# Altium schematic sheet Copy of pilpal_final.SchDoc
size 420 x 297 mm; SheetNumber: 1; SheetTotal: 1
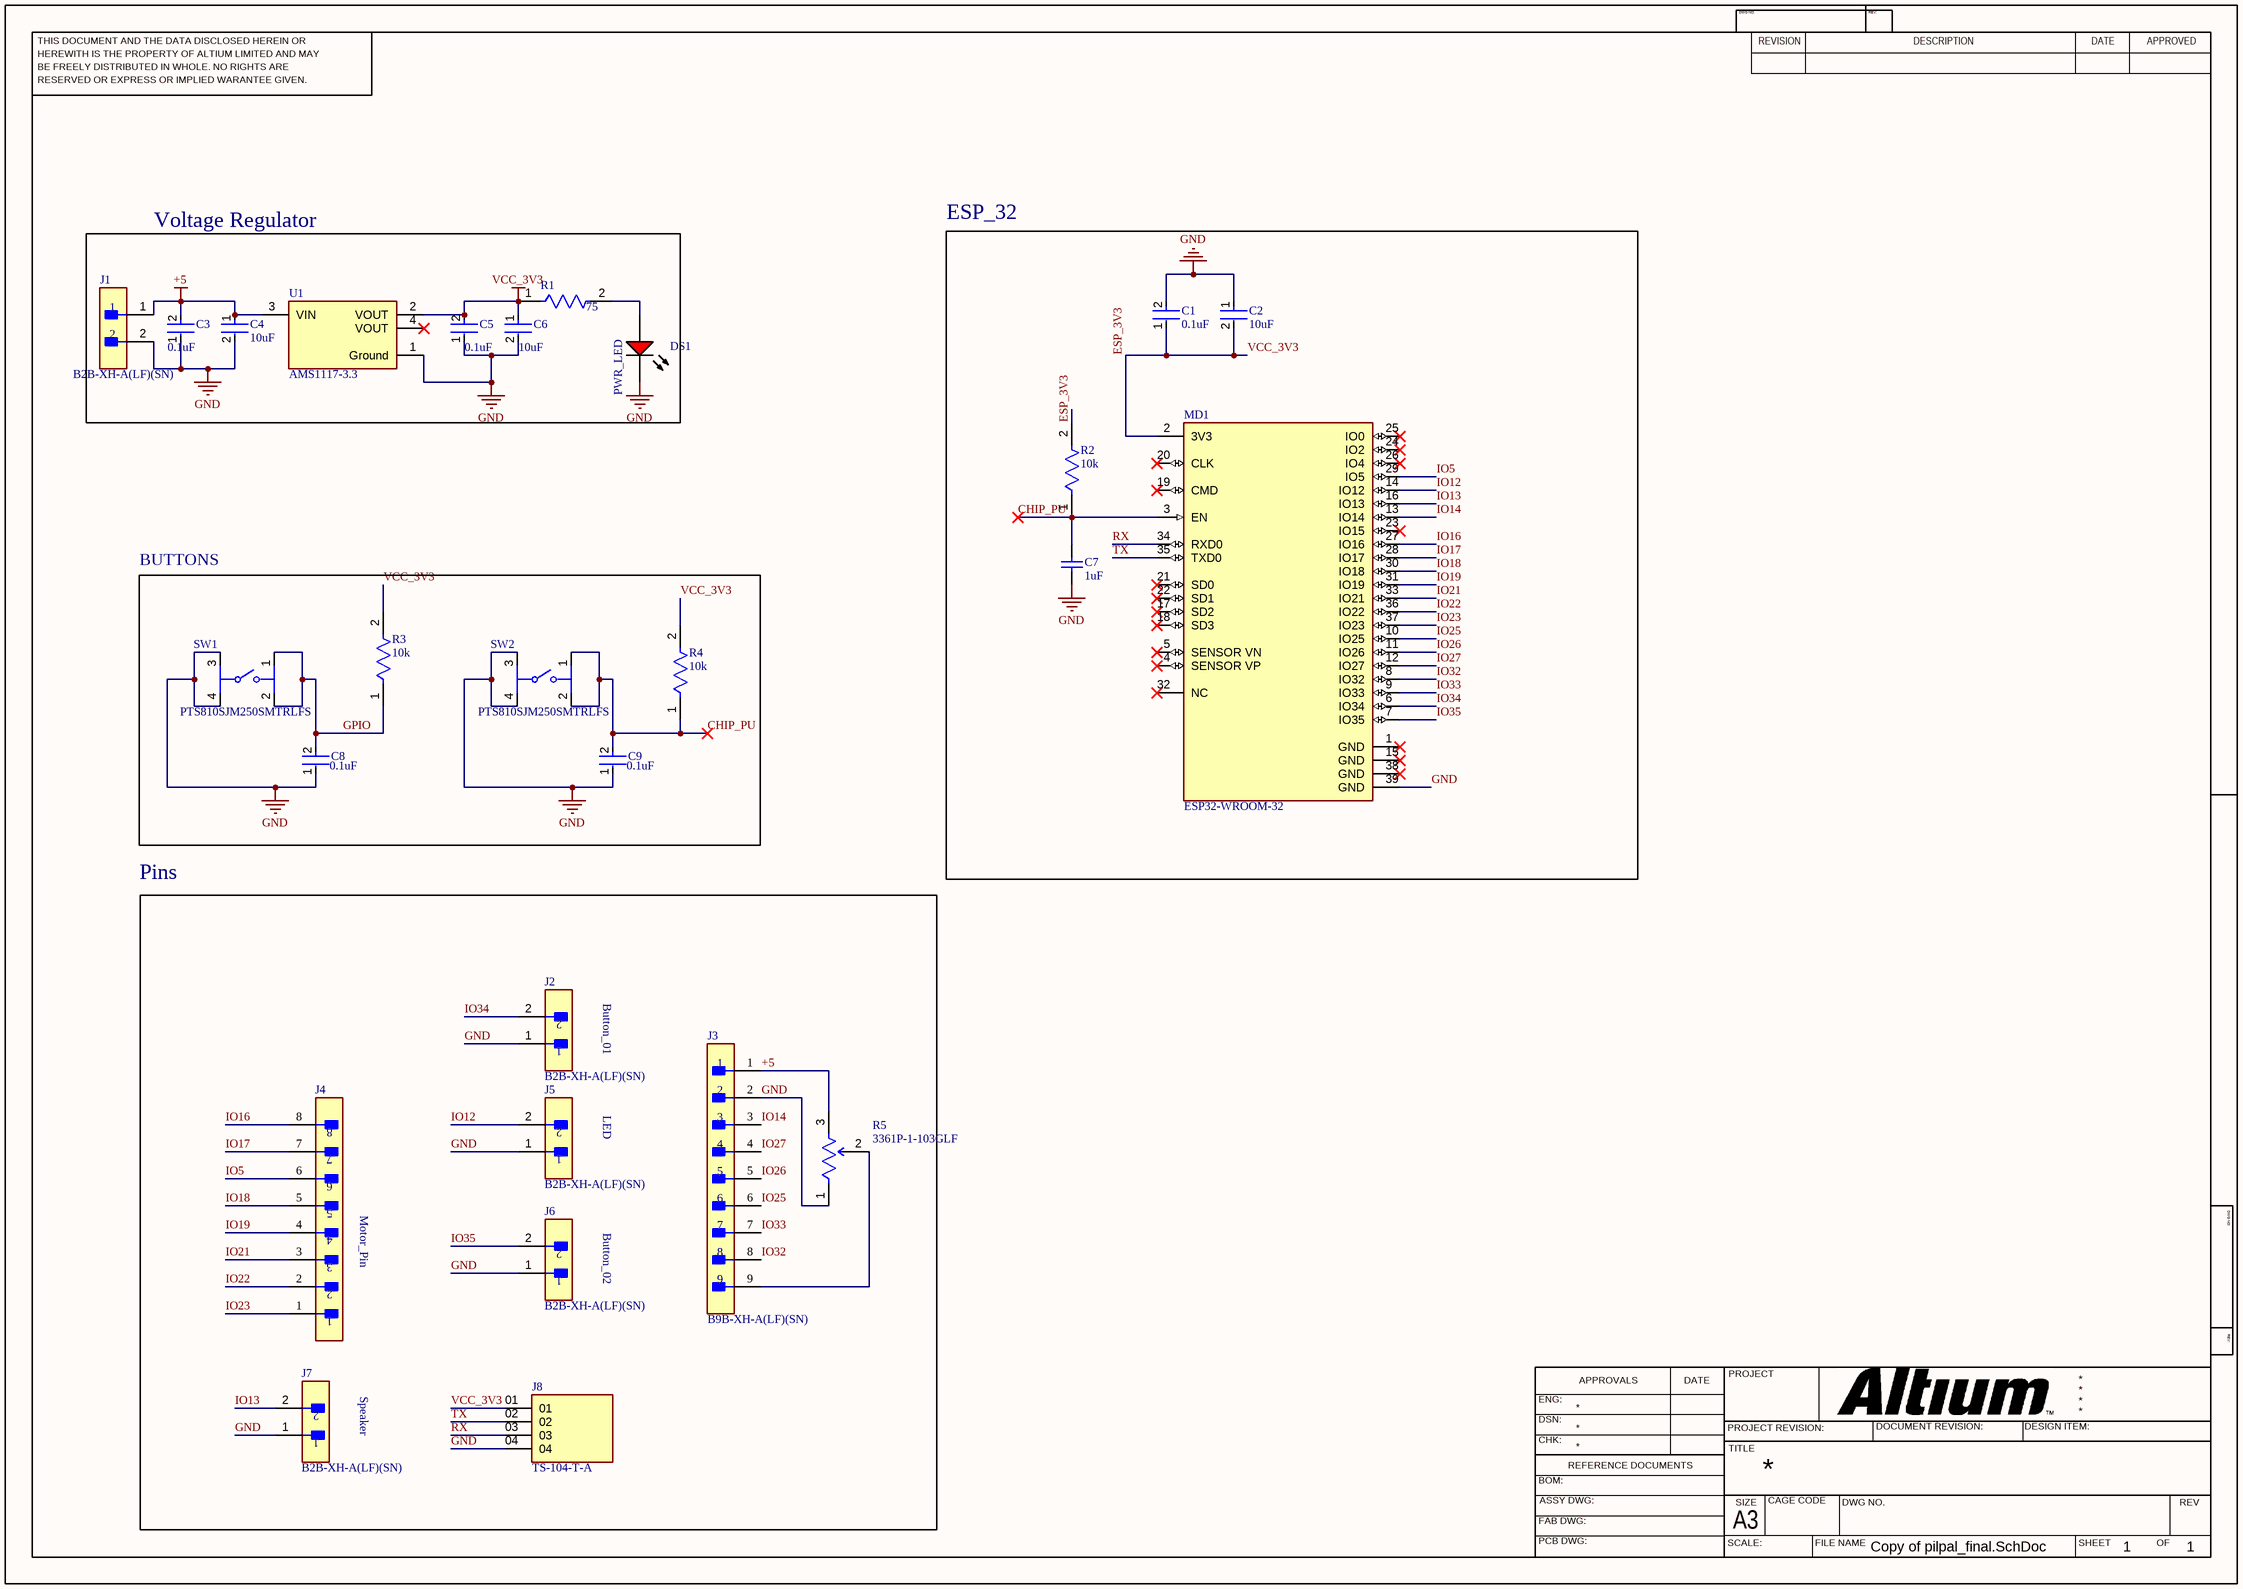
[diagram p0: Copy of pilpal_final.SchDoc]

## Parts
C1  0.1uF  [FP-GRM15-MFG]
C2  10uF  [FP-GRM188-0_1-e0_2_0_55-IPC_A]
C3  0.1uF  [FP-GRM15-MFG]
C4  10uF  [FP-GRM188-0_1-e0_2_0_55-IPC_A]
C5  0.1uF  [FP-GRM15-MFG]
C6  10uF  [FP-GRM188-0_1-e0_2_0_55-IPC_A]
C7  1uF  [CAPC2013X145X50ML20T25]
C8  0.1uF  [FP-GRM15-MFG]
C9  0.1uF  [FP-GRM15-MFG]
DS1  PWR_LED  [AVAG-HSMX-C150_V]
J1  B2B-XH-A(LF)(SN)  [FP-B2B-XH-A_LF_SN-MFG]
J2  B2B-XH-A(LF)(SN)  [FP-B2B-XH-A_LF_SN-MFG]
J3  B9B-XH-A(LF)(SN)  [FP-B9B-XH-A_LF_SN-MFG]
J4  B8B-XH-A(LF)(SN)  [FP-B8B-XH-A_LF_SN-MFG]  (value not drawn)
J5  B2B-XH-A(LF)(SN)  [FP-B2B-XH-A_LF_SN-MFG]
J6  B2B-XH-A(LF)(SN)  [FP-B2B-XH-A_LF_SN-MFG]
J7  B2B-XH-A(LF)(SN)  [FP-B2B-XH-A_LF_SN-MFG]
J8  TS-104-T-A  [SAMTEC_TS-104-T-A]
MD1  ESP32-WROOM-32  [FP-ESP32-WROOM-32-MFG]
R1  75  [FP-RN731J-MFG]
R2  10k  [FP-CRG0805-IPC_C]
R3  10k  [FP-CRG0805-IPC_C]
R4  10k  [FP-CRG0805-IPC_C]
R5  3361P-1-103GLF  [FP-3361P-MFG]
SW1  PTS810SJM250SMTRLFS  [FP-PTS810SJM250SMTRLFS-MFG]
SW2  PTS810SJM250SMTRLFS  [FP-PTS810SJM250SMTRLFS-MFG]
U1  AMS1117-3.3  [FP-AMS1117-IPC_C]

## Blocks framed on the sheet
Voltage Regulator: C3-C6 DS1 J1 R1 U1
ESP_32: C1 C2 C7 MD1 R2
BUTTONS: C8 C9 R3 R4 SW1 SW2
Pins: J2-J8 R5

## Nets
+5: C3.2 C4.1 J1.1 J3.1 R5.3(CW) U1.3(VIN)
ESP_3V3: C1.1 C2.2 C5.2 C6.1 J8.01 MD1.2(3V3) R1.1 R2.2 R3.2 R4.2 U1.2(VOUT)  [also labelled VCC_3V3]
GND: C1.2 C2.1 C3.1 C4.2 C5.1 C6.2 C7.1 C8.1 C9.1 DS1.2(K) J1.2 J2.1 J3.2 J5.1 J6.1 J7.1 J8.04 MD1.39(GND) R5.1(CCW) SW1.3 SW1.4 SW2.3 SW2.4 U1.1(Ground)
CHIP_PU: C7.2 C9.2 MD1.3(EN) R2.1 R4.1 SW2.1 SW2.2
GPIO: C8.2 R3.1 SW1.1 SW1.2
IO5: J4.6 MD1.29(IO5)
IO12: J5.2 MD1.14(IO12)
IO13: J7.2 MD1.16(IO13)
IO14: J3.3 MD1.13(IO14)
IO16: J4.8 MD1.27(IO16)
IO17: J4.7 MD1.28(IO17)
IO18: J4.5 MD1.30(IO18)
IO19: J4.4 MD1.31(IO19)
IO21: J4.3 MD1.33(IO21)
IO22: J4.2 MD1.36(IO22)
IO23: J4.1 MD1.37(IO23)
IO25: J3.6 MD1.10(IO25)
IO26: J3.5 MD1.11(IO26)
IO27: J3.4 MD1.12(IO27)
IO32: J3.8 MD1.8(IO32)
IO33: J3.7 MD1.9(IO33)
IO34: J2.2 MD1.6(IO34)
IO35: J6.2 MD1.7(IO35)
RX: J8.03 MD1.34(RXD0)
TX: J8.02 MD1.35(TXD0)
NetDS1_1: DS1.1(A) R1.2
NetJ3_9: J3.9 R5.2(WIPER)

Not connected (* = marked no-connect by the designer): MD1 1(GND)* 4(SENSOR_VP)* 5(SENSOR_VN)* 15(GND)* 17(SD2)* 18(SD3)* 19(CMD)* 20(CLK)* 21(SD0)* 22(SD1)* 23(IO15)* 24(IO2)* 25(IO0)* 26(IO4)* 32(NC)* 38(GND)*; U1 4(VOUT)*

## Notes on the sheet
- Button_01
- LED
- (near J4) Motor_Pin
- Button_02
- Speaker
- THIS DOCUMENT AND THE DATA DISCLOSED HEREIN OR
- HEREWITH IS THE PROPERTY OF ALTIUM LIMITED AND MAY
- DWG NO:
- REVISION
- REV:
- DESCRIPTION
- DATE
- APPROVED
- BE FREELY DISTRIBUTED IN WHOLE. NO RIGHTS ARE
- RESERVED OR EXPRESS OR IMPLIED WARANTEE GIVEN.
- ENG:
- APPROVALS
- PROJECT
- DSN:
- CHK:
- REFERENCE DOCUMENTS
- PROJECT REVISION:
- TITLE
- DOCUMENT REVISION:
- DESIGN ITEM:
- BOM:
- FAB DWG:
- PCB DWG:
- ASSY DWG:
- SCALE:
- A3
- SIZE
- CAGE CODE
- FILE NAME
- DWG NO.
- SHEET
- OF
- REV

## Library data of the parts
C1 C3 C5 C8 C9 = CMP-2100-03641-2: CAP CER 0.1UF 16V X7R 0402; Manufacturer Part Number: GRM155R71C104KA88D; Manufacturer: Murata; Standoff Height: 0mm; Tolerance: 10%; Voltage Rating: 16Vdc; Material: Ceramic; Capacitance: 0.10μF; Value: 0.10μF; RoHS: TRUE; Temperature Characteristic: X7R; Octopart: https://octopart.com/grm155r71c104ka88d-murata-196880; Digikey Description: CAP CER 0.1UF 16V X7R 0402; Device Class L3: Ceramic Capacitors; Height: 0.55mm; ComponentLink2Description: Datasheet; Temperature Range Low: -55°C; Ipc Land Pattern Name: CAPC10050X219; ComponentLink2URL: https://search.murata.co.jp/Ceramy/image/img/A01X/G101/ENG/GRM155R71H471KA01-01A.pdf; Device Class L1: Passive Components; Lead Free: yes; Category: Cap; Package: GRM15; Temperature: -55°C to +125°C; Device Class L2: Capacitors; Temperature Range High: +125°C; Mouser Description: 0402 0.1 uF 16V ±10 % Tolerance X7R SMT Multilayer Ceramic Capacitor
C2 C4 C6 = CMP-2006-02792-2: Chip Multilayer Ceramic Capacitors for General Purpose, 0603, 10uF, X5R, 15%, 20%, 6.3V; Packaging: Tape and Reel; Voltage Rating (DC): 6.3V; Width: 0.031inch; Termination: SMD/SMT; Dielectric: X5R; Package Quantity: 4000; Voltage Rating: 6.3V; Capacitance: 10uF; Case/Package: 0603; Min Operating Temperature: -55°C; Voltage: 6.3V; Length: 1.6mm; Thickness: 0.035inch; Lead Free: Lead Free; Depth: 0.8mm; Case Code (Imperial): 0603; Max Operating Temperature: 85°C; Material: Ceramic; Height: 0.8mm; Tolerance: 20%; Mount: Surface Mount; REACH SVHC: No SVHC; Radiation Hardening: No; Case Code (Metric): 1608
C7 = CMP-1036-04731-2: Part Number: C0805C105K9PACTU; Manufacturer: Kemet
DS1 = CMP-2000-06426-1: LED Uni-Color Red, 65 mW, 25 mA, -40 to 85 degC, 2-Pin SMD, RoHS, Tape and Reel; Manufacturer: Avago; Product Height (mm): 1.1mm; Power Dissipation: 78W; Product Length (mm): 3.2mm; Forward Voltage: 2.6V; Luminous Intensity: 17mcd; DELETED: Compliant; Shape Type: Rectangular; Peak Wavelength: 660nm; Main Category: ChipLED; Dominant Wave Length: 639nm; Rad Hardened: No; Lens Type: ColorlessDiffused; Product Depth (mm): 1.6mm; Reverse Voltage: 5V; Forward Current: 25mA; Chip Material: GaAlAs; Test Current (It): 20mA; Viewing Angle: 170deg; Number of  Elements: 1; Type: Uni-Color; Package Reference: HSMX-C150; Package Description: 2-Pin Surface Mount Device, Body 3.2 x 1.6 mm; Operating Temp Range: -40Cto85C; Mounting: SurfaceMount; Emitting Color: Red; Pin Count: 2; Operating Temperature Classification: Industrial; Datasheet URL: http://media.digikey.com/pdf/Data%20Sheets/Avago%20PDFs/HSMz-Czzz.pdf; Package Type: ChipLed; Mounting Technology: SurfaceMount; High Brightness: No; Lens Dimensions: 2x1.6x0.6mm; Manufacturer URL: http://www.avagotech.com/; Lum Intensity: 17mcd; Datasheet Version: 03/2012; Packaging: TapeandReel
J1 J2 J5-J7 = CMP-2000-05888-3: CONN HEADER VERT 2POS 2.5MM; Current Rating: 3A; Voltage Rating: 250V; Number of Contacts: 2; Contact Resistance: 20mR; Wire/Cable Gauge: 22AWG; Insulation Resistance: 1GR; Connector Type: Male Pin; Packaging: Bulk; Contact Material: Brass; Lead Free: Lead Free; Orientation: Straight; Contact Plating: Tin; Max Current Rating: 3A; Termination: Solder; Fastening Type: Detent; Depth: 5.75mm; Housing Material: Polyamide; REACH SVHC: No SVHC; Series: XH; Voltage Rating (AC): 250V; Number of Positions: 2; Color: Natural; Contact Type: Male Pin; Max Voltage Rating (DC): 250V; Pitch: 2.5mm; Lead Pitch: 2.5mm; Mount: Through Hole; Max Operating Temperature: 85°C; Length: 7.4mm; Max Voltage Rating (AC): 250V; Min Operating Temperature: -25°C; Number of Rows: 1; Housing Color: White
J3 = CMP-17439-000168-1: CONN HEADER VERT 9POS 2.5MM; Wire/Cable Gauge: 22AWG; Current Rating: 3A; Insulation Resistance: 1GR; Mated Stacking Heights: 9.8mm; Max Voltage Rating (AC): 250V; Contact Resistance: 20mR; Gender: Male; Number of Contacts: 9; Orientation: Straight; Contact Finish - Mating: TIN; Number of Rows: 1; Max Operating Temperature: 85°C; Contact Plating: Tin; Flammability Rating: UL94 V-0; Length: 24.9mm; REACH SVHC: No SVHC; Depth: 5.75mm; Housing Color: White; Package Quantity: 250; Lead Pitch: 2.5mm; Connector Type: Header; Voltage Rating (AC): 250V; Packaging: Bulk; Color: Natural; Min Operating Temperature: -25°C; Insulation Color: Natural; Insulation Material: Nylon; Voltage Rating: 250V; Pitch: 2.5mm; Lead Free: Lead Free; Contact Shape: Square; Housing Material: Polyamide; Series: XH; Termination: Solder; Contact Type: Male Pin; Mount: Through Hole; Max Current Rating: 3A; Number of Positions: 9; Contact Material: Brass; Fastening Type: Detent
J4 = CMP-17438-000015-1: CONN HEADER VERT 8POS 2.5MM; Voltage Rating (AC): 250V; Insulation Resistance: 1GR; Connector Type: Male Pin; Max Current Rating: 3A; Wire/Cable Gauge: 22AWG; Number of Contacts: 8; Contact Resistance: 20mR; Orientation: Straight; Pitch: 2.5mm; Min Operating Temperature: -25°C; Number of Rows: 1; Contact Type: Male Pin; Packaging: Bulk; Lead Free: Lead Free; Max Operating Temperature: 85°C; Housing Material: Polyamide; Voltage Rating: 250V; Series: XH; Mount: Through Hole; Depth: 5.75mm; Contact Material: Brass; Fastening Type: Detent; Color: Natural; Max Voltage Rating (AC): 250V; Number of Positions: 8; Housing Color: White; Contact Plating: Tin; Lead Pitch: 2.5mm; Length: 22.4mm; REACH SVHC: No SVHC; Termination: Press-Fit; Current Rating: 3A
J8 = TS-104-T-A: TS - Samtec 2.54mm Single Row Machined Terminal Strip - Fast Stock; MF: Samtec Inc.; Check_prices: https://www.snapeda.com/parts/TS-104-T-A/Samtec+Inc./view-part/?ref=eda; Value: *; Availability: In Stock; Price: None; Package: None; MP: TS-104-T-A; SnapEDA_Link: https://www.snapeda.com/parts/TS-104-T-A/Samtec+Inc./view-part/?ref=snap; Purchase-URL: https://pricing.snapeda.com/search/part/TS-104-T-A/?ref=eda; Supplier 1: Digikey; Supplier Part Number 1: SAM1112-04-ND
MD1 = CMP-194065-000008-1: RX TXRX MOD WIFI SURFACE MOUNT; Frequency: 2.5GHz; Sensitivity: -98dBm; Operating Supply Voltage: 3.6V; Data Rate: 150Mbps; Weight: 0.088185oz; Package Quantity: 550; Min Operating Temperature: -40°C; Mount: Surface Mount; Max Operating Temperature: 85°C; Packaging: Cut Tape; Case/Package: SMD/SMT
R1 = CMP-03211-006003-1: Thin Film Resistors RN 0603 750Ω 0.1% 10ppm/°C; Manufacturer: TE Connectivity; Manufacturer Part Number: RN73C1J750RBTG; Voltage Rating: 50V; Power Rating: 0.063W; Tolerance: 0.1%; Resistance: 750Ω; Device Class L3: Chip SMD Resistors; Lead Free: Yes; Series: RN73; Device Class L2: Resistors; Temperature Coefficient: 10ppm/°C; Height: 0.55mm; Ipc Land Pattern Name: RESC15580X45; Category: Res; Value: 750Ω; Temperature Range Low: -55°C; ComponentLink2URL: https://www.te.com/commerce/DocumentDelivery/DDEController?Action=showdoc&DocId=Data+Sheet%7F1773270%7FP%7Fpdf%7FEnglish%7FENG_DS_1773270_P.pdf%7F9-1614352-9; Package: RN731J; Automotive: No; ComponentLink2Description: Datasheet; Composition: Thin Film; Device Class L1: Passive Components; Octopart: https://octopart.com/rn73c1j750rbtg-te+connectivity-41131173; Temperature Range High: +155°C; octopart_url: https://octopart.com/rn73c1j750rbtg-te+connectivity-41131173; Temperature: -55°C to +155°C; RoHS: TRUE; packaging: 250 cut tape length
R2-R4 = CMP-03211-011401-1: RES SMD 10K OHM 1% 1/8W 0805; Temperature Coefficient: 100ppm/°C; Power Rating: 125mW; Resistance: 10kR; Voltage Rating: 150V; Number of Resistors: 1; RoHS Compliant: Yes; Tolerance: 1%; Mount: Surface Mount; Radiation Hardening: No; Depth: 1.25mm; Termination: Solder; Series: CRG Series; Packaging: Tape and Reel; Number of Terminations: 2; Resistor Type: Thick Film; Length: 2mm; Height: 0.55mm; ELV: Compliant; Case/Package: 0805; Min Operating Temperature: -55°C; Max Operating Temperature: 125°C; Technology: THICK FILM
R5 = CMP-07234-000045-1: TRIMMER 10K OHM 0.5W GW TOP ADJ; Power Rating: 500mW; Temperature Coefficient: 100ppm/°C; Tolerance: 10%; Voltage Rating (DC): 300V; Resistance: 10kR; Number of Turns: 1; RoHS Compliant: Yes; Technology: CERMET; Packaging: Tape and Reel; Width: 0.264inch; Weight: 0.567g; Max Operating Temperature: 125°C; REACH SVHC: No SVHC; Series: Trimpot® 3361 - Sealed; Lead Free: Lead Free; Depth: 8.53mm; Taper: Linear; Package Quantity: 1; Min Operating Temperature: -55°C; Termination: Gull Wing; Radiation Hardening: No; Height: 0.205inch; Contact Plating: Tin; Voltage Rating: 300V; Length: 6.71mm; Max Power Dissipation: 500mW; Mount: Surface Mount; Military Standard: Not; Color: Natural; Resistor Type: Cermet; Resistance Tolerance: 10%
SW1 SW2 = CMP-10040-000001-2: SWITCH TACTILE SPST-NO 0.05A 16V; Throw Configuration: SPST; Operating Force: 160gf; Actuator Type: Standard; Switch Travel: 0.15mm; Switch Function: Off-Mom; Max Current Rating: 50mA; Mechanical Life: 150000Cycles; Illumination Type: Non-Illuminated; Package Quantity: 2900; Depth: 4.6mm; Mount: Surface Mount; Packaging: Tape and Reel; Length: 3.2mm; RoHS Compliant: Yes; Case/Package: SMD/SMT; Voltage Rating (DC): 16V; Min Operating Temperature: -40°C; Termination: J-Bend; Lead Free: Lead Free; Contact Plating: Silver; Orientation: Straight; Max Operating Temperature: 85°C; Current Rating: 50mA; Color: Black
U1 = CMP-209535-000001-1: LDO Voltage Regulators 1A, 3.3V; Manufacturer: Advanced Monolithic Systems; Dropout Voltage: 1.1V; Output Type: Fixed; Nominal Supply Current: 5mA; Max Power Dissipation: 1.2W; Max Supply Voltage: 15V; Number Of Outputs: 1; Standoff Height: 0.64mm; Max Junction Temp: +125°C; Height: 1.8mm; Package: AMS1117; Device Class L2: Power Management ICs; ComponentLink2Description: Datasheet; ComponentLink2URL: http://www.advanced-monolithic.com/pdf/ds1117.pdf; Category: IC; RoHS: TRUE; Automotive: No; Device Class L1: Integrated Circuits (ICs); Output Current: 1A; Device Class L3: Voltage Regulators - Linear; Temperature: -40°C to +125°C; Output Voltage: 3.3V; Manufacturer Part Number: AMS1117-3.3; Temperature Range Low: -40°C; Octopart: https://octopart.com/ams1117-3.3-advanced+monolithic+systems-25899300; Lead Free: Yes; Ipc Land Pattern Name: SOT229P700X180-4; Temperature Range High: +125°C